# Altium schematic sheet Sheet1.SchDoc
size A4; SheetNumber: 1; SheetTotal: 1
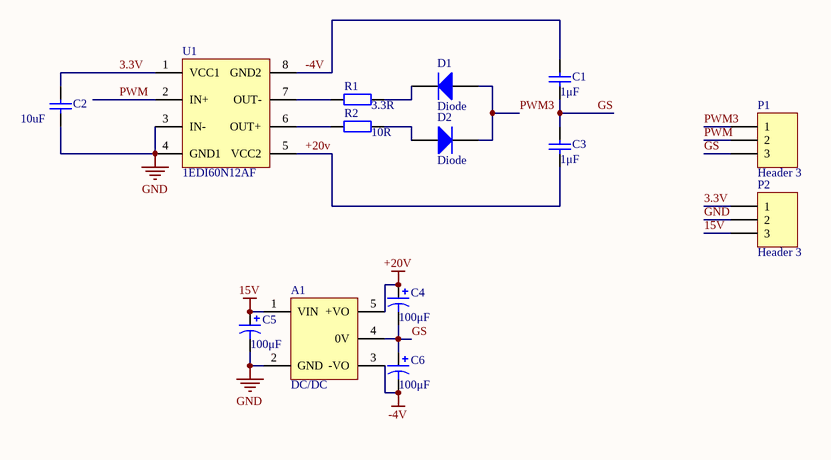
[diagram p0: Sheet1.SchDoc]

## Parts
A1  DC/DC  [DC/DC+-12 QD]
C1  value 1μF  [DuShi]  (hidden comment: Cap)
C2  value 10uF  [BAT-2]  (hidden comment: Cap)
C3  value 1μF  [DuShi]  (hidden comment: Cap)
C4  value 100μF  [CAP-3]  (hidden comment: Cap Pol1)
C5  value 100μF  [CAP-3]  (hidden comment: Cap Pol1)
C6  value 100μF  [CAP-3]  (hidden comment: Cap Pol1)
D1  Diode  [DIODE-0.4]
D2  Diode  [DIODE-0.4]
P1  Header 3  [HDR1X3]
P2  Header 3  [HDR1X3]
R1  value 3.3R  [AXIAL-0.4]  (hidden comment: Res2)
R2  value 10R  [AXIAL-0.4]  (hidden comment: Res2)
U1  1EDI60N12AF  [SOIC-8]

## Nets
15V: A1.1(VIN) C5.1 P2.3
+20v: A1.5(+VO) C3.1 C4.1 U1.5(VCC2)
-4V: A1.3(-VO) C1.2 C6.2 U1.8(GND2)
GND: A1.2(GND) C2.1 C5.2 P2.2 U1.3(IN-) U1.4(GND1)
3.3V: C2.2 P2.1 U1.1(VCC1)
GS: A1.4(0V) C1.1 C3.2 C4.2 C6.1 P1.3
PWM: P1.2 U1.2(IN+)
PWM3: D1.1(A) D2.2(K) P1.1
NetD1_2: D1.2(K) R1.2
NetD2_1: D2.1(A) R2.2
NetR1_1: R1.1 U1.7(OUT-)
NetR2_1: R2.1 U1.6(OUT+)

## Library data of the parts
C1-C3 = Cap: Capacitor; Published: 8-Jun-2000; LatestRevisionDate: 17-Jul-2002; LatestRevisionNote: Re-released for DXP Platform.; PackageReference: RAD-0.3; Publisher: Altium Limited; PackageDescription: Radial Cap, Thru-Hole; 2 Leads; 0.3 in Pin Spacing
C4-C6 = Cap Pol1: Polarized Capacitor (Radial); Published: 8-Jun-2000; LatestRevisionDate: 17-Jul-2002; LatestRevisionNote: Re-released for DXP Platform.; PackageReference: RB7.6-15; Publisher: Altium Limited; PackageDescription: Polarized Capacitor (Radial); 2 Leads
D1 D2 = Diode: Default Diode; Published: 8-Jun-2000; LatestRevisionDate: 17-Jul-2002; LatestRevisionNote: Re-released for DXP Platform.; PackageVersion: Sep-1996; PackageReference: SMC; Publisher: Altium Limited; PackageDescription: DO-214-AB/SMC; 2 C-Bend Leads; Body 7.9 x 5.9 mm, inc. leads (LxW); Code_JEDEC: DO-214-AB
P1 P2 = Header 3: Header, 3-Pin; LatestRevisionDate: 17-Jul-2002; LatestRevisionNote: Re-released for DXP Platform.; Publisher: Altium Limited
R1 R2 = Res2: Resistor; Published: 8-Jun-2000; LatestRevisionDate: 17-Jul-2002; LatestRevisionNote: Re-released for DXP Platform.; PackageReference: AXIAL-0.4; Publisher: Altium Limited; PackageDescription: Axial Device, Thru-Hole; 2 Leads; 0.4 in Pin Spacing